# EAGLE schematic ltc3783-boost-driver-test-mk-1.0.0 (EAGLE 6.6.0)
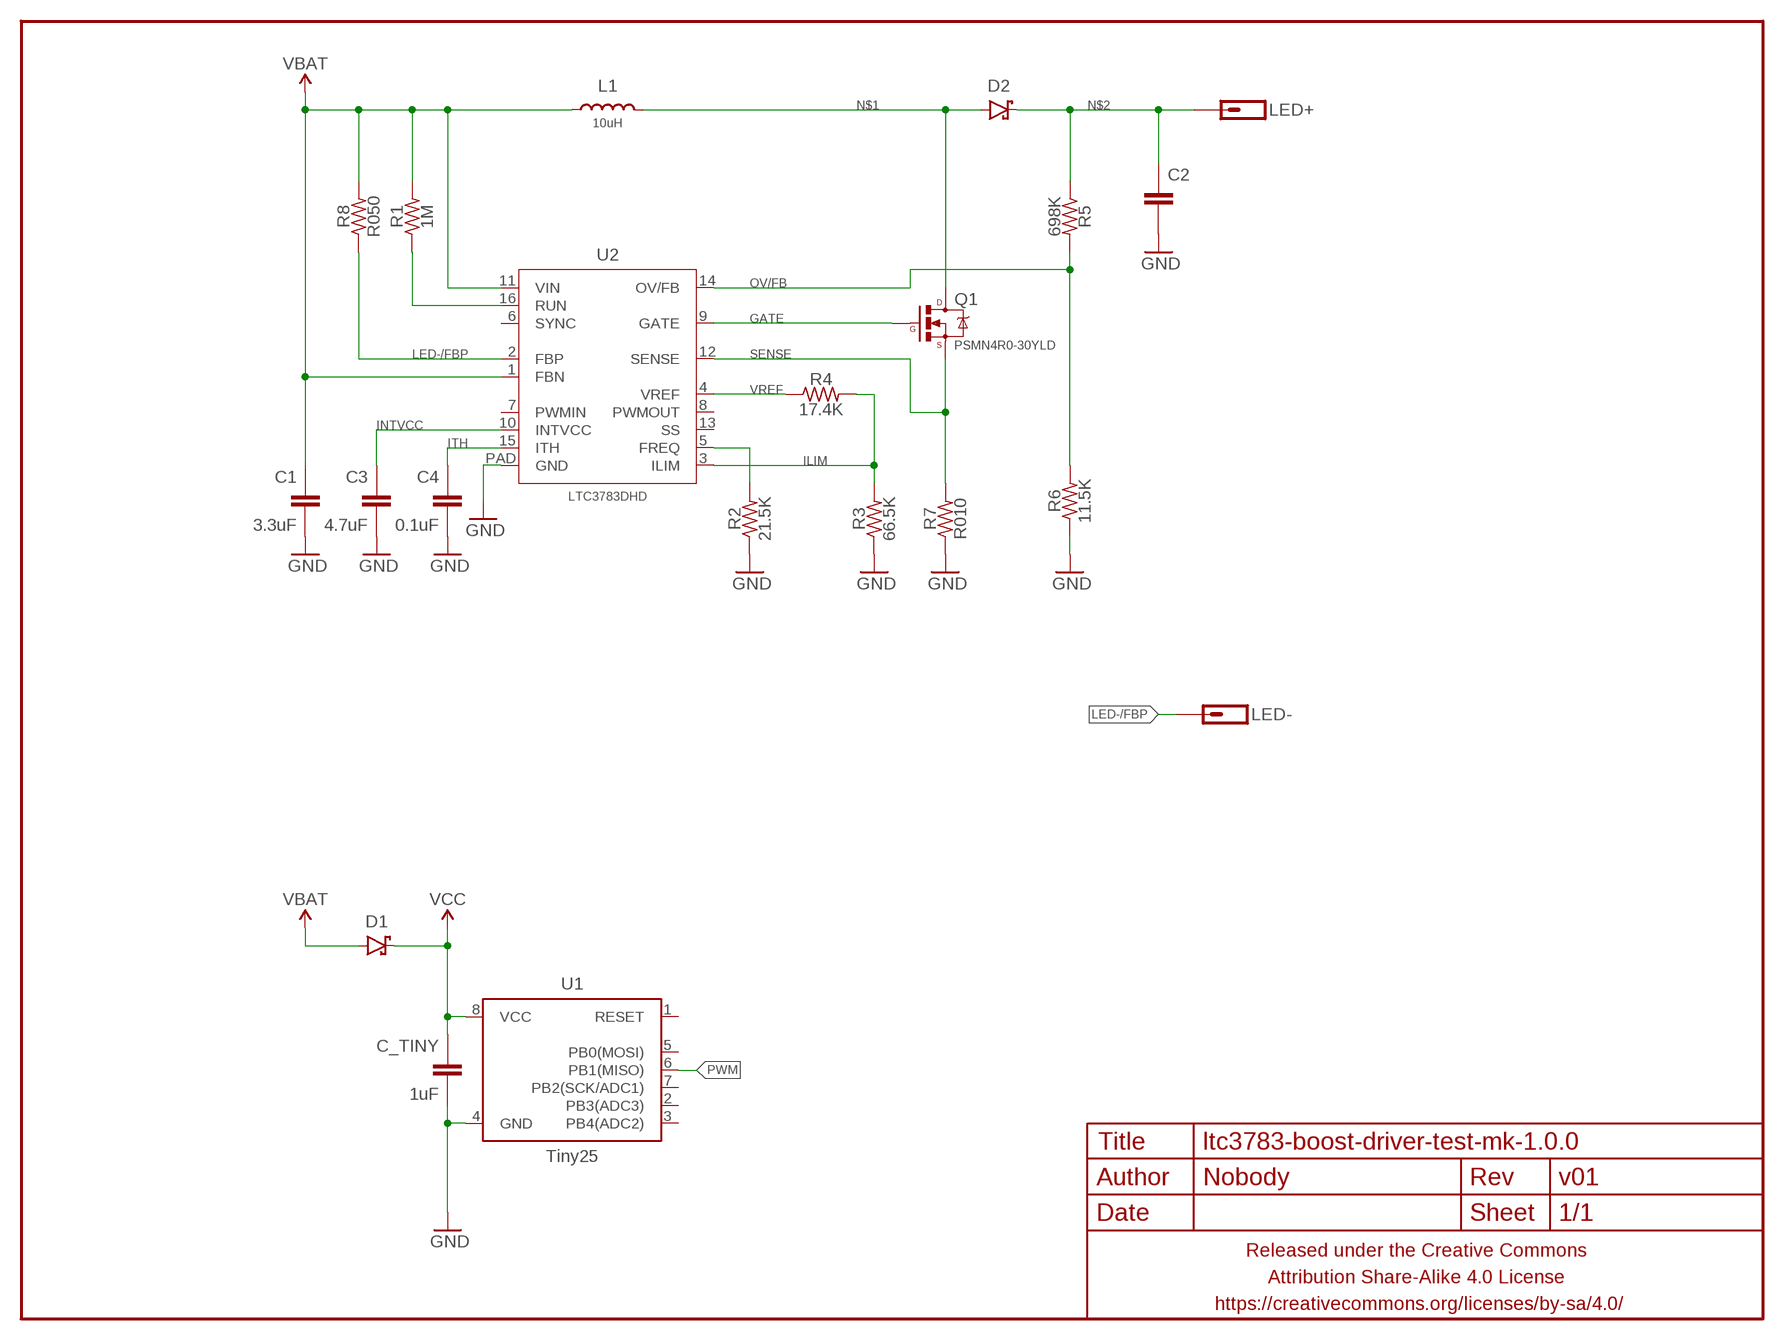
[diagram p0: schematic, sheet 1]

## Parts
C1  3.3uF  CAPACITOR-CERAMICC0805-TIGHTER  [C0805-TIGHTER]
C2  CAPACITOR-CERAMICC0805-TIGHTER  [C0805-TIGHTER]
C3  4.7uF  CAPACITOR-CERAMICC0603-TIGHTER  [C0603-TIGHTER]
C4  0.1uF  CAPACITOR-CERAMICC0603-TIGHTER  [C0603-TIGHTER]
C_TINY  1uF  CAPACITOR-CERAMICC0402  [C0402]
D1  DIODE-SCHOTTKYSOD323  [SOD323-SCHOTTKY]
D2  DIODE-SCHOTTKYSOD323  [SOD323-SCHOTTKY]
FRAME1  FRAME-LETTERNO_PACKAGE  [DUMMY]
L1  10uH  INDUCTORXAL40X0  [XAL40X0]
LED+  M01NOT-A-VIA-NOPE  [1X01_NOSILK_NOSTOP]
LED-  M01NOT-A-VIA-NOPE  [1X01_NOSILK_NOSTOP]
Q1  PSMN4R0-30YLD  MOSFET-NCHANNELLFPAK33  [LFPAK33]
R1  1M  RESISTORR0603-TIGHTER  [R0603-TIGHTER]
R2  21.5K  RESISTORR0603-TIGHTER  [R0603-TIGHTER]
R3  66.5K  RESISTORR0603-TIGHTER  [R0603-TIGHTER]
R4  17.4K  RESISTORR0603-TIGHTER  [R0603-TIGHTER]
R5  698K  RESISTORR0603-TIGHTER  [R0603-TIGHTER]
R6  11.5K  RESISTORR0603-TIGHTER  [R0603-TIGHTER]
R7  R010  RESISTORR0805-TIGHTER  [R0805-TIGHTER]
R8  R050  RESISTORR0805-TIGHTER  [R0805-TIGHTER]
U1  Tiny25  ATTINY45TINY25-SOICN-NARROWER  [SO08-SKINNYPADS]
U2  LTC3783DHD  [DFN400X400-16N]

## Nets
GATE: Q1.4(G) U2.9(GATE)
GND: C1.2 C2.2 C3.2 C4.2 C_TINY.2 R2.1 R3.1 R6.1 R7.1 U1.4(GND) U2.PAD(GND)
ILIM: R3.2 R4.2 U2.3(ILIM)
INTVCC: C3.1 U2.10(INTVCC)
ITH: C4.1 U2.15(ITH)
LED-/FBP: LED-.P$1 R8.1 U2.2(FBP)
N$1: D2.A L1.P$2 Q1.PAD(D)
N$2: C2.1 D2.C LED+.P$1 R5.1
N$4: R2.2 U2.5(FREQ)
OV/FB: R5.2 R6.2 U2.14(OV/FB)
PWM: U1.6(PB1(MISO))
RUN: R1.1 U2.16(RUN)
SENSE: Q1.1(S) Q1.2(S) Q1.3(S) R7.2 U2.12(SENSE)
VBAT: C1.1 D1.A L1.P$1 R1.2 R8.2 U2.1(FBN) U2.11(VIN)
VCC: C_TINY.1 D1.C U1.8(VCC)
VREF: R4.1 U2.4(VREF)
Unconnected: U1.1(RESET) U1.2(PB3(ADC3)) U1.3(PB4(ADC2)) U1.5(PB0(MOSI)) U1.7(PB2(SCK/ADC1)) U2.6(SYNC) U2.7(PWMIN) U2.8(PWMOUT) U2.13(SS)

## Library data of the parts
C1-C4 C_TINY = a_parts:CAPACITOR-CERAMIC: CAPACITOR, European symbol
D1 D2 = a_parts:DIODE-SCHOTTKY: Schottky diodes in SFE's production catalog BAT20J 1A 23V 0.62Vf RB751 120mA 40V 0.37Vf PMEG4005EJ 0.5A 40V 0.42Vf MBRA140 1A 40V 0.5Vf B340A 3A 40V SMA
FRAME1 = a_parts:FRAME-LETTER: Schematic Frame Standard 8.5x11 US Letter frame; DESIGNER: Nobody; VERSION: v01
L1 = a_parts:INDUCTOR: Inductors Basic Inductor/Choke - 0603 and 1206. Footprints are not proven and vary greatly between part numbers. SRN6045- 33uH, 20% 1.4A SDR0403-560KL - 56uH, 10%, 500mA RMS/740mA peak
LED+ LED- = a_parts:M01: Header 1 Standard 1-pin 0.1" header. Use with straight break away headers (SKU : PRT-00116), right angle break away headers (PRT-00553), swiss pins (PRT-00743), machine pins (PRT-00117), and female headers (PRT-00115).
Q1 = a_parts:MOSFET-NCHANNEL: Common NMOSFET Parts MFG P/N Store ID Prod ID FDD8780 TRANS-09984 SI7820DN TRANS-11055 FDS6630A IC-08089 2N7002PW TRANS-11151 FQP30N06L COM-10213 TRANS-10060 BSS123LT1G TRANS-08345 BSS138 TRANS-00830 BS170 2N7000
R1-R8 = a_parts:RESISTOR: RESISTOR, American symbol
U1 = a_parts:ATTINY45: Atmel 8-pin 2/4/8kB flash uC
U2 = a_parts:LTC3783